# Altium schematic sheet schematich.schdoc
size 295 x 187 mm
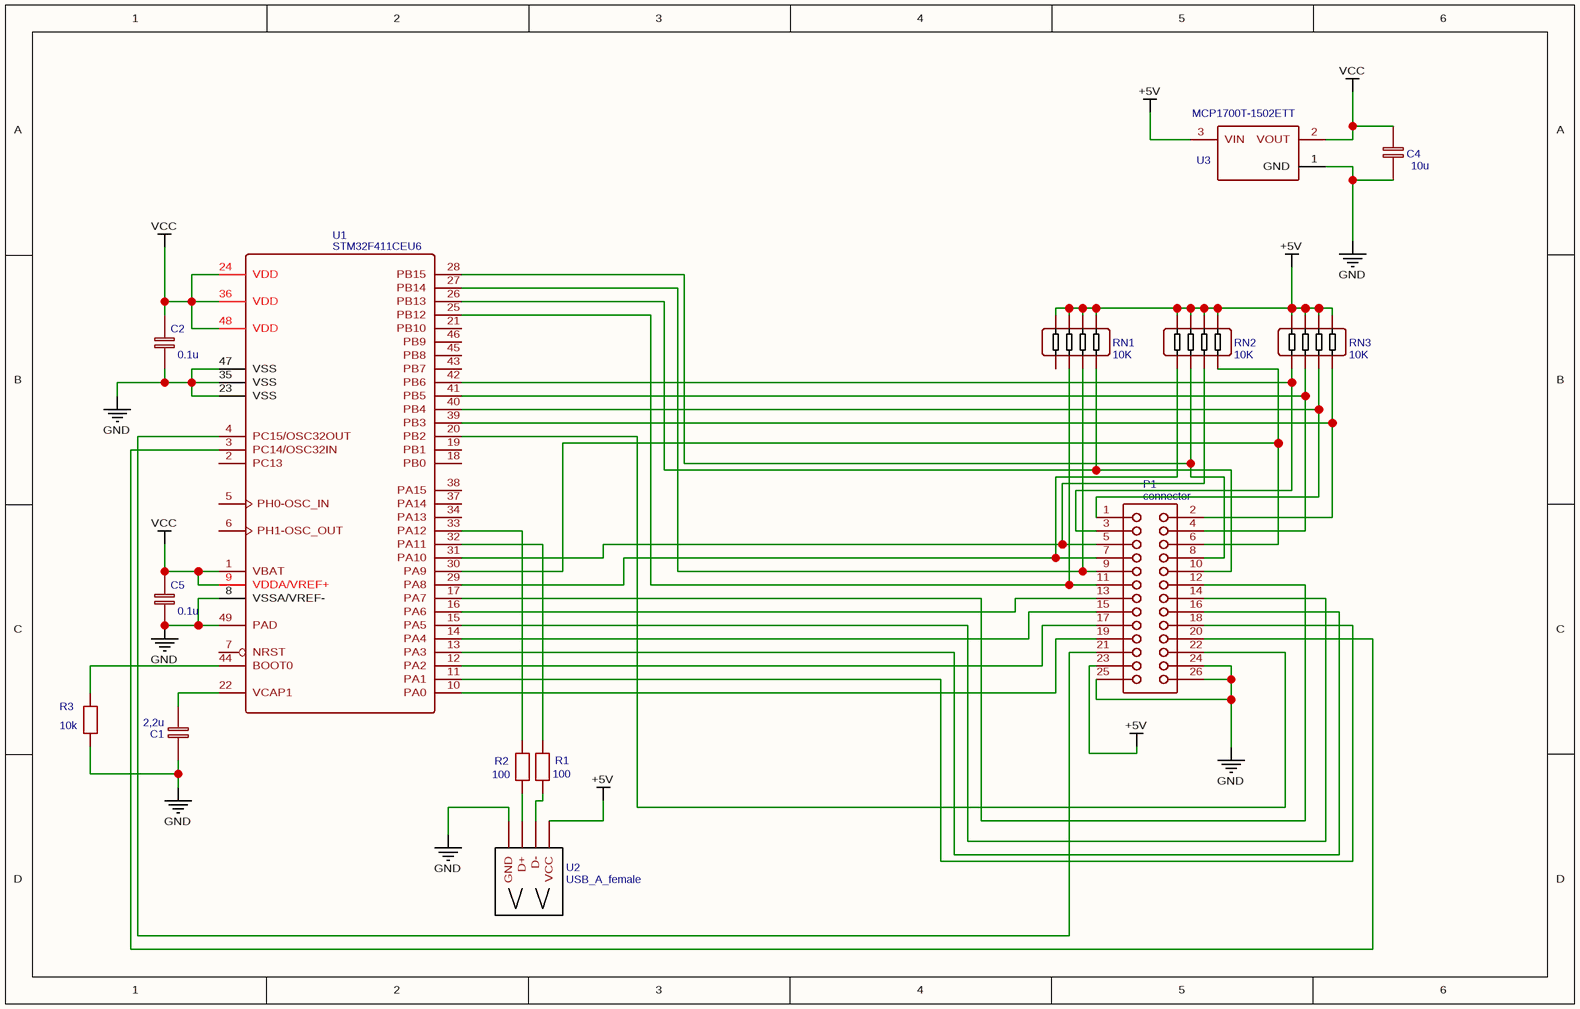
[diagram p0: schematich.schdoc]

## Parts
C1  2,2u  [C0805]
C2  0.1u  [C0805]
C4  10u  [C0805]
C5  0.1u  [C0805]
P1  connector  [CONNECTOR26]
R1  100  [R0603]
R2  100  [R0603]
R3  10k  [R0603]
RN1  10K  [RES-ARRAY-SMD_0603-8P-L3.2-W1.6-BL]
RN2  10K  [RES-ARRAY-SMD_0603-8P-L3.2-W1.6-BL]
RN3  10K  [RES-ARRAY-SMD_0603-8P-L3.2-W1.6-BL]
U1  STM32F411CEU6  [UFQFPN-48_L7.0-W7.0-P0.50-BL-EP]
U2  USB_A_female  [USB A FEMALE TH P4]
U3  MCP1700T-1502ETT  [SOT23-3]

## Nets
+5V: P1.23 RN1.5 RN1.6 RN1.7 RN1.8 RN2.5 RN2.6 RN2.7 RN2.8 RN3.5 RN3.6 RN3.7 RN3.8 U2.1(VCC) U3.3(VIN)
GND: C1.2 C2.1 C4.2 C5.1 P1.24 P1.25 P1.26 R3.1 U1.8(VSSA/VREF-) U1.23(VSS) U1.35(VSS) U1.47(VSS) U1.49(PAD) U2.4(GND) U3.1(GND)
VCC: C2.2 C4.1 C5.2 U1.1(VBAT) U1.9(VDDA/VREF+) U1.24(VDD) U1.36(VDD) U1.48(VDD) U3.2(VOUT)
NetC1_1: C1.1 U1.22(VCAP1)
NetP1_1: P1.1 RN3.3 U1.40(PB4)
NetP1_2: P1.2 RN3.4 U1.39(PB3)
NetP1_3: P1.3 P1.11 RN1.2 RN3.1 U1.25(PB12) U1.42(PB6)
NetP1_4: P1.4 RN3.2 U1.41(PB5)
NetP1_5: P1.5 RN2.3 U1.31(PA10)
NetP1_6: P1.6 RN2.4 U1.30(PA9)
NetP1_7: P1.7 RN2.1 U1.29(PA8)
NetP1_8: P1.8 RN2.2 U1.28(PB15)
NetP1_9: P1.9 RN1.3 U1.27(PB14)
NetP1_10: P1.10 RN1.4 U1.26(PB13)
NetP1_12: P1.12 U1.17(PA7)
NetP1_13: P1.13 U1.16(PA6)
NetP1_14: P1.14 U1.15(PA5)
NetP1_15: P1.15 U1.14(PA4)
NetP1_16: P1.16 U1.13(PA3)
NetP1_17: P1.17 U1.12(PA2)
NetP1_18: P1.18 U1.11(PA1)
NetP1_19: P1.19 U1.10(PA0)
NetP1_20: P1.20 U1.3(PC14/OSC32IN)
NetP1_21: P1.21 U1.4(PC15/OSC32OUT)
NetP1_22: P1.22 U1.20(PB2)
NetR1_1: R1.1 U2.2(D-)
NetR1_2: R1.2 U1.32(PA11)
NetR2_1: R2.1 U2.3(D+)
NetR2_2: R2.2 U1.33(PA12)
NetR3_2: R3.2 U1.44(BOOT0)

Not connected (* = marked no-connect by the designer): RN1 1; U1 2(PC13) 5(PH0-OSC_IN) 6(PH1-OSC_OUT) 7(NRST) 18(PB0) 19(PB1) 21(PB10) 34(PA13) 37(PA14) 38(PA15) 43(PB7) 45(PB8) 46(PB9)

## Library data of the parts
C1 = 2,2u: nameAlias: Value(F); Contributor: LCEDA_Lib; spicePre: C; spiceSymbolName: C_0805_EU
C2 C5 = 0.1u: nameAlias: Value(F); Contributor: LCEDA_Lib; spicePre: C; spiceSymbolName: C_0805_EU
C4 = 10u: nameAlias: Value(F); Contributor: LCEDA_Lib; spicePre: C; spiceSymbolName: C_0805_EU
P1 = connector: description: Flat Cable Connector (IDC), PCB Transition Connector, 2 Rows, Solder Pin, 26 Contacts; Contributor: Watsapol; spicePre: P; spiceSymbolName: connector
R1 R2 = 100: nameAlias: Value(Ω); Contributor: LCEDA_Lib; spicePre: R; spiceSymbolName: R_0603_EU
R3 = 10k: nameAlias: Value(Ω); Contributor: LCEDA_Lib; spicePre: R; spiceSymbolName: R_0603_EU
RN1-RN3 = 10K: BOM_Manufacturer: UNI-ROYAL(Uniroyal Elec); BOM_Manufacturer Part: 4D03WGF1002T5E; nameAlias: Resistance (Ohms); Contributor: LCSC; BOM_Supplier: LCSC; BOM_Supplier Part: C425238; spicePre: R; spiceSymbolName: 4D03WGF1002T5E
U1 = STM32F411CEU6: BOM_Manufacturer: STMicroelectronics; BOM_Supplier: LCSC; BOM_Manufacturer Part: STM32F411CEU6; BOM_Supplier Part: C60420; BOM_JLCPCB Part Class: Extended Part; spicePre: U; spiceSymbolName: STM32F411CEU6
U2 = USB_A_female: Contributor: cultofsnake; spicePre: U; spiceSymbolName: USB_A_female
U3 = MCP1700T-1502ETT: description: Low Quiescent Current LDO, 3-Pin SOT-23, Extended Temperature, Tape and Reel; spicePre: U; spiceSymbolName: MCP1700T-1502ETT